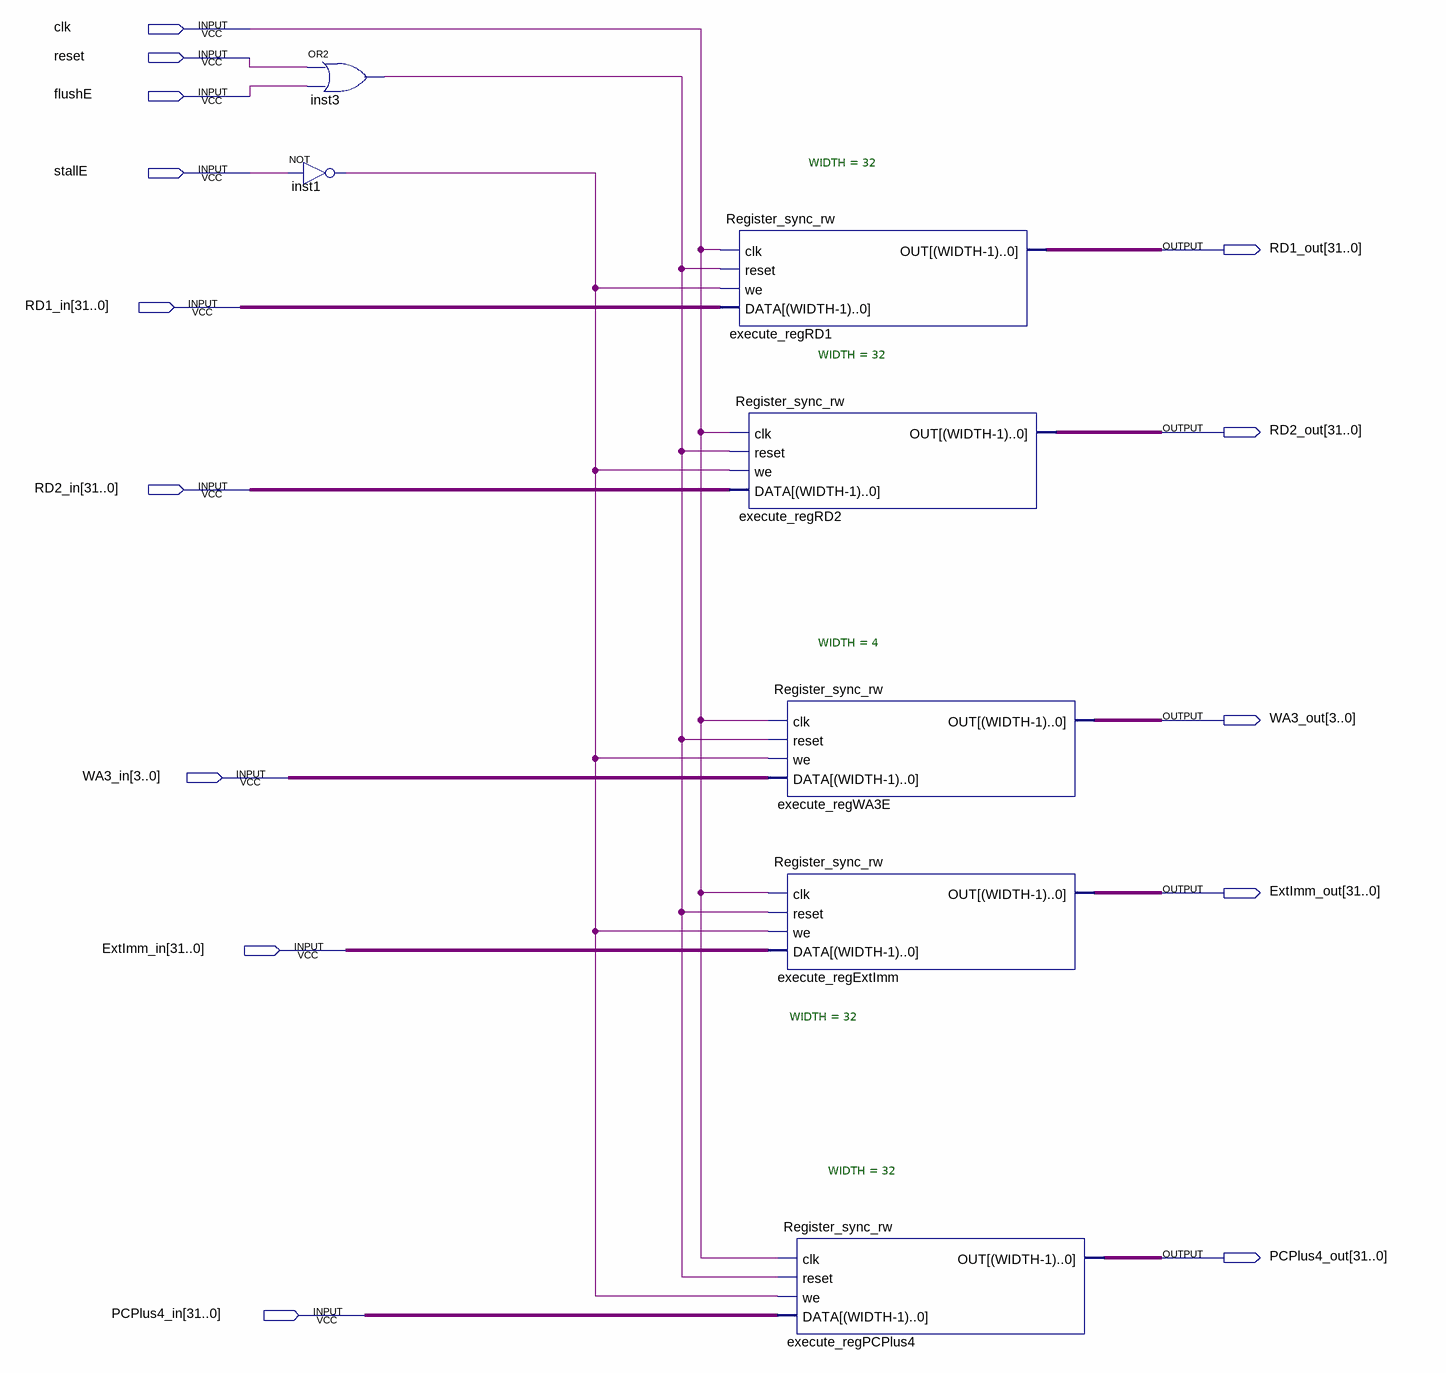
[diagram p0: schematic sheet]
// Quartus schematic execute_register.bdf as structural Verilog: 7 symbols, 14 pins
module execute_register (
  input  clk,
  input  reset,
  input  flushE,
  input  stallE,
  input  [31:0] RD1_in,
  input  [31:0] RD2_in,
  input  [3:0] WA3_in,
  input  [31:0] ExtImm_in,
  input  [31:0] PCPlus4_in,
  output [31:0] RD1_out,
  output [31:0] RD2_out,
  output [3:0] WA3_out,
  output [31:0] ExtImm_out,
  output [31:0] PCPlus4_out
);

  wire inst1_out, inst3_out;

  not inst1 (inst1_out, stallE);
  or inst3 (inst3_out, reset, flushE);
  Register_sync_rw #(.WIDTH(32)) execute_regRD1 (
    .clk(clk), .reset(inst3_out), .we(inst1_out), .DATA(RD1_in), .OUT(RD1_out));
  Register_sync_rw #(.WIDTH(32)) execute_regRD2 (
    .clk(clk), .reset(inst3_out), .we(inst1_out), .DATA(RD2_in), .OUT(RD2_out));
  Register_sync_rw #(.WIDTH(4)) execute_regWA3E (
    .clk(clk), .reset(inst3_out), .we(inst1_out), .DATA(WA3_in), .OUT(WA3_out));
  Register_sync_rw #(.WIDTH(32)) execute_regExtImm (
    .clk(clk), .reset(inst3_out), .we(inst1_out), .DATA(ExtImm_in), .OUT(ExtImm_out));
  Register_sync_rw #(.WIDTH(32)) execute_regPCPlus4 (
    .clk(clk), .reset(inst3_out), .we(inst1_out), .DATA(PCPlus4_in), .OUT(PCPlus4_out));
endmodule
